# EAGLE design Breadboard-ATMEGA328 (EAGLE 7.5.0)
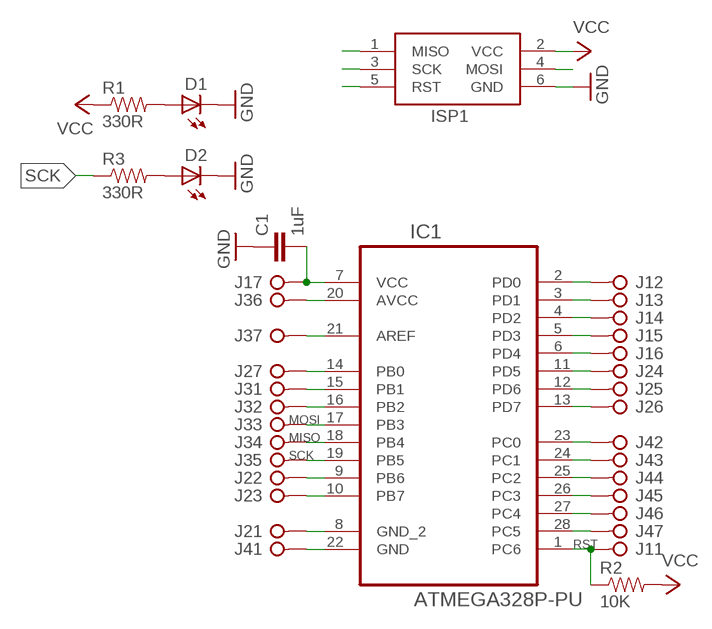
[diagram p0: schematic, sheet 1]

## Parts
C1  1uF  CAPACITOR-0805  [CAPACITOR-0805]
D1  LED-0805  [LED-0805]
D2  LED-0805  [LED-0805]
IC1  ATMEGA328P-PU  [DIP28]
ISP1  ICSP-HEADER-6  [ICSP-HEADER]
J1  PINHD-1X7  [1X07]
J2  PINHD-1X7  [1X07]
J3  PINHD-1X7  [1X07]
J4  PINHD-1X7  [1X07]
R1  330R  RESISTOR-0805  [RESISTOR-0805]
R2  10K  RESISTOR-0805  [RESISTOR-0805]
R3  330R  RESISTOR-0805  [RESISTOR-0805]

## Nets
GND: C1.1 D1.2(C) D2.2(C) IC1.8(GND_2) ISP1.6(GND) J2.1
MISO: IC1.18(PB4) ISP1.1(MISO) J3.4
MOSI: IC1.17(PB3) ISP1.4(MOSI) J3.3
N$1: IC1.22(GND) J4.1
N$2: IC1.2(PD0) J1.2
N$3: IC1.3(PD1) J1.3
N$4: IC1.4(PD2) J1.4
N$5: IC1.5(PD3) J1.5
N$6: IC1.6(PD4) J1.6
N$7: D1.1(A) R1.2
N$8: D2.1(A) R3.2
N$9: IC1.9(PB6) J2.2
N$10: IC1.10(PB7) J2.3
N$11: IC1.11(PD5) J2.4
N$12: IC1.12(PD6) J2.5
N$13: IC1.13(PD7) J2.6
N$14: IC1.14(PB0) J2.7
N$15: IC1.15(PB1) J3.1
N$16: IC1.16(PB2) J3.2
N$21: IC1.21(AREF) J3.7
N$23: IC1.23(PC0) J4.2
N$24: IC1.24(PC1) J4.3
N$25: IC1.25(PC2) J4.4
N$26: IC1.26(PC3) J4.5
N$27: IC1.27(PC4) J4.6
N$28: IC1.28(PC5) J4.7
RST: IC1.1(PC6) ISP1.5(RST) J1.1 R2.1
SCK: IC1.19(PB5) ISP1.3(SCK) J3.5 R3.1
VCC: C1.2 IC1.7(VCC) IC1.20(AVCC) ISP1.2(VCC) J1.7 J3.6 R1.1 R2.2

## Library data of the parts
C1 = SaintGimp:CAPACITOR-*: Ceramic Capacitor
D1 D2 = SaintGimp:LED-*
IC1 = SaintGimp:ATMEGA328P-PU: 8-bit Microcontroller with In-System Programmable Flash; MPN: ATMEGA328P-PU; OC_FARNELL: 1715487; OC_NEWARK: 15R0268; PACKAGE: PDIP-28; SUPPLIER: Atmel
ISP1 = SaintGimp:ICSP-HEADER: ICSP HEADER Standard 6 pin header for ICSP programming
J1-J4 = SaintGimp:PINHD-1X7
R1-R3 = SaintGimp:RESISTOR-*

## Board
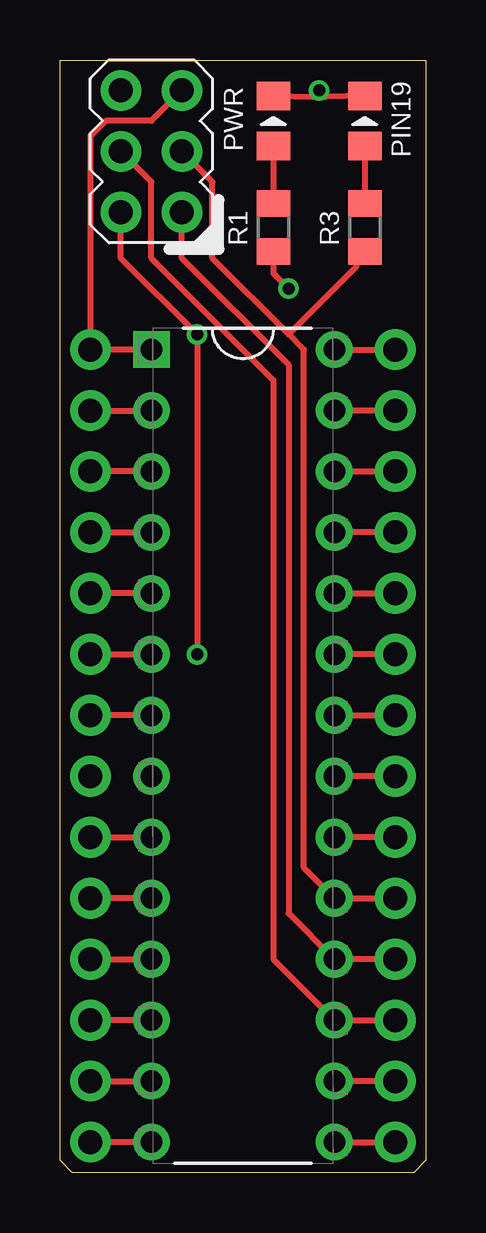
[diagram p1: board, top side]
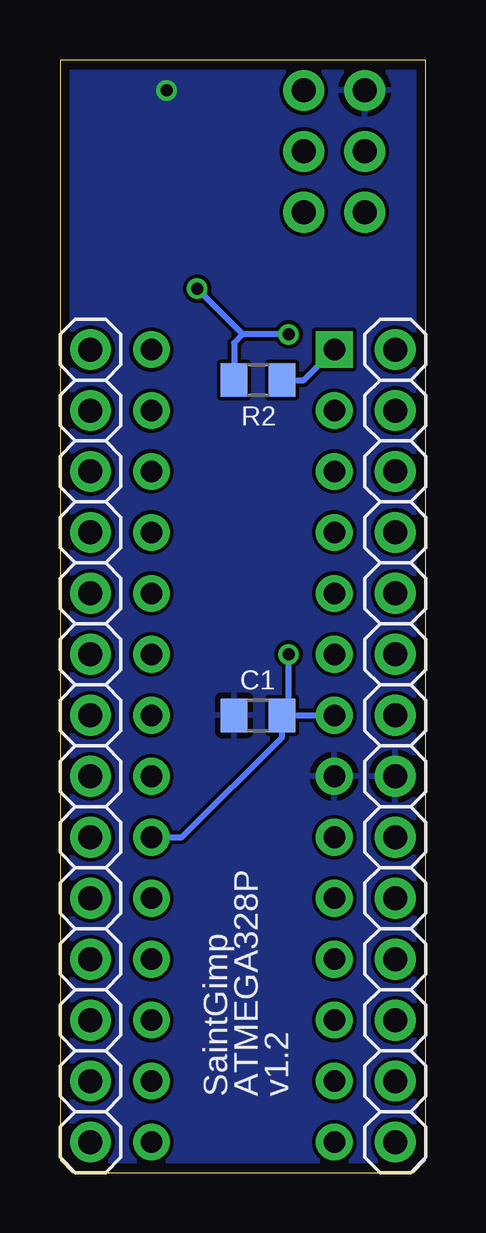
[diagram p2: board, bottom side, seen from below]

Size 15.24 x 46.35 mm. Coordinates in mm from the lower left corner, seen from the top.
Outline: 0,0.51 0,46.35 15.24,46.35 15.24,0.51 14.73,0 0.51,0 0,0.51
Copper layers (1*16): Top 0.0356mm / dielectric 1.5011mm / Bottom 0.0356mm
Design rules "Saintgimp-OSHPark *": minimum track width 10mil, minimum drill 13mil, track to track 6mil, track to pad 6mil, pad to pad 6mil, via to via 6mil, smd to smd 6mil, copper to edge 15mil, drill to drill 6mil, minimum pad ring 10mil, minimum via ring 7mil, stop-mask expansion 2mil, vias tented up to drill 24mil, thermal gap 10mil

### Footprints (pad centres in the part's own frame; a part is rotated, then mirrored left to right if it is on the bottom)
CAPACITOR-0805 = smd 1.1 x 1.4: 1 -1,0; 2 1,0
LED-0805 = smd 1.194 x 1.4: 1 -1.047,0; 2 1.047,0
DIP28 = drill 0.9 square: 1 -7.62,33.02 | drill 0.9: 2 -7.62,30.48; 3 -7.62,27.94; 4 -7.62,25.4; 5 -7.62,22.86; 6 -7.62,20.32; 7 -7.62,17.78; 8 -7.62,15.24; 9 -7.62,12.7; 10 -7.62,10.16; 11 -7.62,7.62; 12 -7.62,5.08; 13 -7.62,2.54; 14 -7.62,0; 15 0,0; 16 0,2.54; 17 0,5.08; 18 0,7.62; 19 0,10.16; 20 0,12.7; 21 0,15.24; 22 0,17.78; 23 0,20.32; 24 0,22.86; 25 0,25.4; 26 0,27.94; 27 0,30.48; 28 0,33.02
ICSP-HEADER = drill 1: 1 -1.27,2.54; 2 1.27,2.54; 3 -1.27,0; 4 1.27,0; 5 -1.27,-2.54; 6 1.27,-2.54
1X07 = drill 1: 1 -7.62,0; 2 -5.08,0; 3 -2.54,0; 4 0,0; 5 2.54,0; 6 5.08,0; 7 7.62,0
RESISTOR-0805 = smd 1.1 x 1.4: 1 -1,0; 2 1,0

### Placement (x,y rotation side)
C1  6.99,19.05 0 bottom
D1  8.89,43.81 90 top
D2  12.7,43.81 90 top
IC1  11.43,1.27 0 top
ISP1  3.81,42.55 180 top
J1  1.27,26.67 270 bottom
J2  1.27,8.89 270 bottom
J3  13.97,8.89 90 bottom
J4  13.97,26.67 90 bottom
R1  8.89,39.37 90 top
R2  6.99,33.02 180 bottom
R3  12.7,39.37 90 top

### Tracks (layer width: path | path; a pad name or v marks a point on that pad's centre or on a via)
GND  (via drill 0.5)
  Top 0.254: D1.2 10.53,44.81 v10.79,45.09 11.06,44.81 D2.2
  pour Bottom: 0,46.35 15.24,46.35 15.24,0 0,0
MISO
  Top 0.254: J3.4 IC1.18 9.53,10.79 9.53,33.66 5.08,38.1 ISP1.1
MOSI
  Top 0.254: J3.3 IC1.17 8.89,8.89 8.89,33.02 3.81,38.1 3.81,41.27 ISP1.4
N$1
  Top 0.254: IC1.22 J4.1
N$2
  Top 0.254: J1.2 IC1.2
N$3
  Top 0.254: IC1.3 J1.3
N$4
  Top 0.254: J1.4 IC1.4
N$5
  Top 0.254: IC1.5 J1.5
N$6
  Top 0.254: J1.6 IC1.6
N$7
  Top 0.254: D1.1 R1.2
N$8
  Top 0.254: D2.1 R3.2
N$9
  Top 0.254: J2.2 IC1.9
N$10
  Top 0.254: IC1.10 J2.3
N$11
  Top 0.254: J2.4 IC1.11
N$12
  Top 0.254: IC1.12 J2.5
N$13
  Top 0.254: J2.6 IC1.13
N$14
  Top 0.254: IC1.14 J2.7
N$15
  Top 0.254: IC1.15 J3.1
N$16
  Top 0.254: J3.2 IC1.16
N$21
  Top 0.254: J3.7 IC1.21
N$23
  Top 0.254: J4.2 IC1.23
N$24
  Top 0.254: IC1.24 J4.3
N$25
  Top 0.254: J4.4 IC1.25
N$26
  Top 0.254: IC1.26 J4.5
N$27
  Top 0.254: J4.6 IC1.27
N$28
  Top 0.254: IC1.28 J4.7
RST
  Top 0.254: IC1.1 J1.1 1.27,43.18 1.91,43.81 3.81,43.81 ISP1.5
  Bottom 0.254: R2.1 5.08,33.02 IC1.1
SCK
  Top 0.254: J3.5 IC1.19 10.16,12.7 10.16,34.29 9.53,34.92 | ISP1.3 6.35,41.27 6.35,38.1 9.53,34.92 | R3.1 12.34,38.37 12.34,37.73 9.53,34.92
VCC  (via drill 0.5)
  Top 0.254: IC1.7 J1.7 | J3.6 IC1.20 | v5.71,21.59 v5.71,34.92 2.54,38.1 ISP1.2 | R1.1 8.89,37.47 v9.53,36.83
  Bottom 0.254: C1.2 IC1.7 | C1.2 5.71,19.32 v5.71,21.59 | IC1.20 10.16,13.97 5.99,18.14 C1.2 | v5.71,34.92 7.62,34.92 | v9.53,36.83 7.62,34.92 | 7.62,34.92 7.99,34.56 R2.2

### Text on the board
_tsilk: PWR | PIN19
_bsilk: v1.2 | ATMEGA328P | SaintGimp